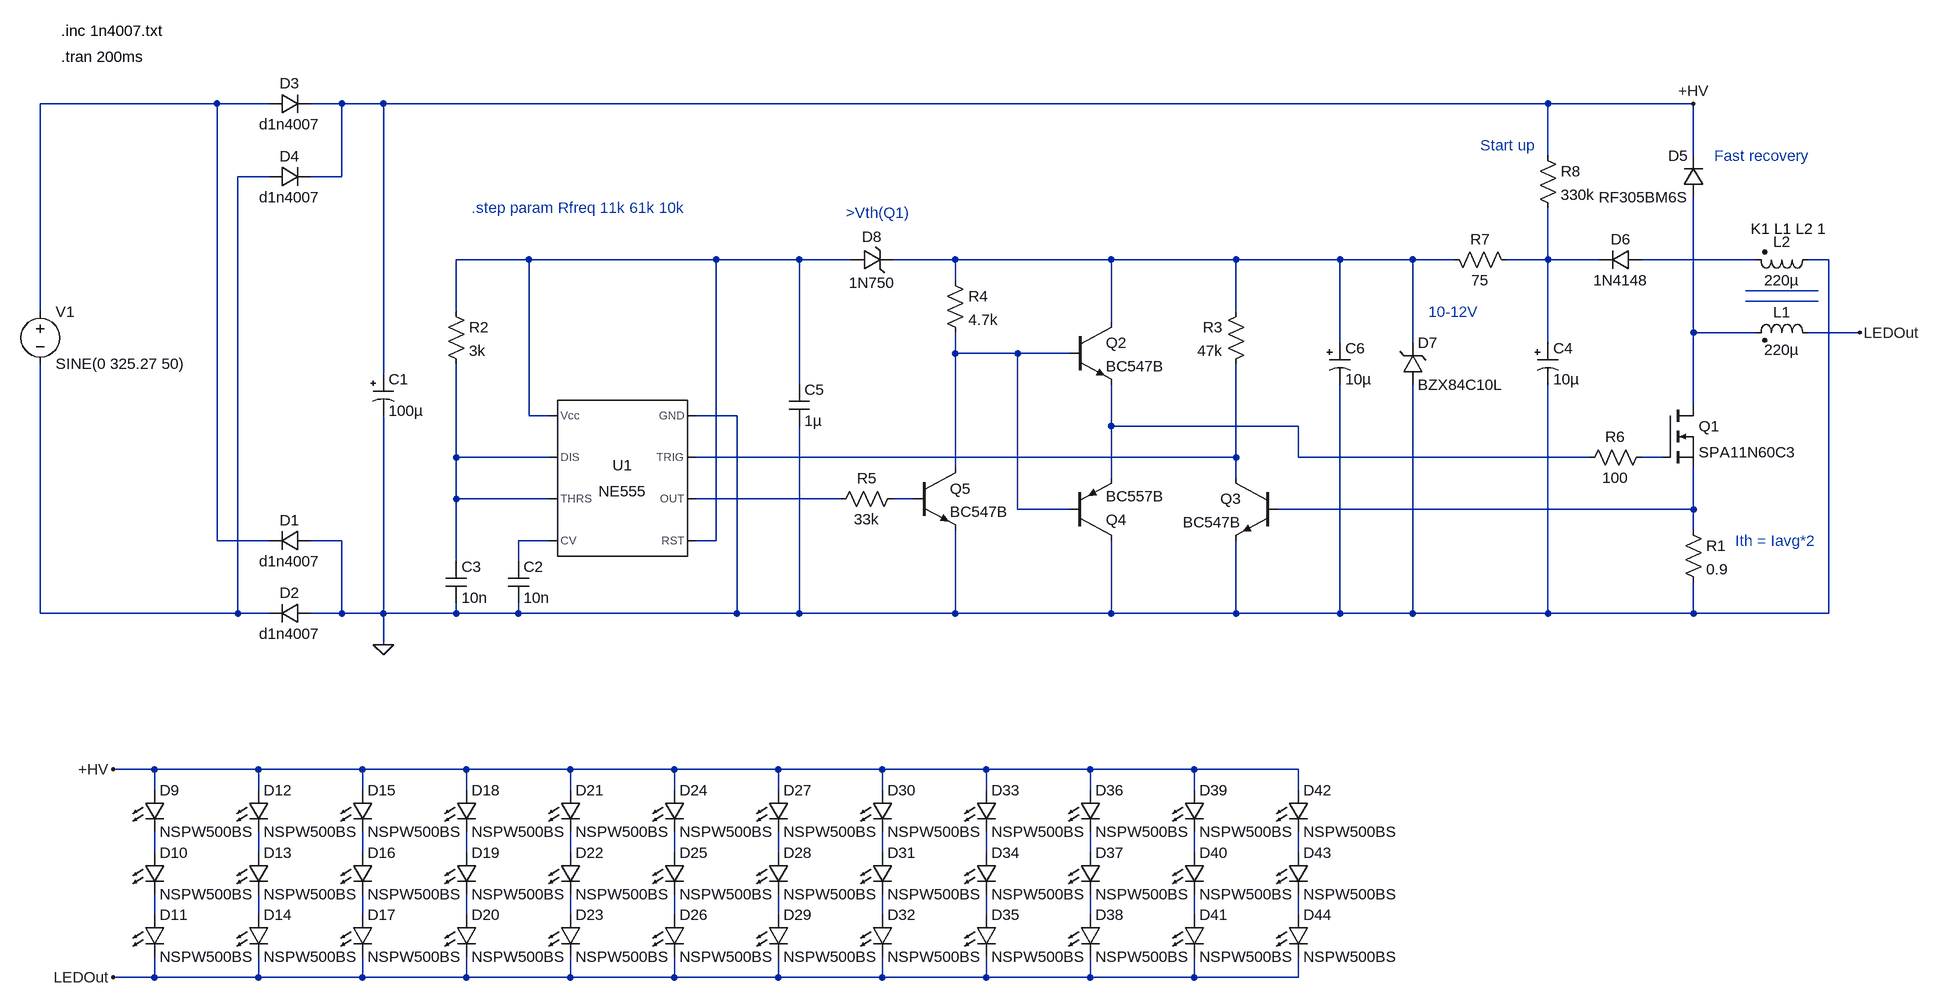
[diagram p0: schematic AC LED Driver LoV PP.asc]
AC LED Driver LoV PP.asc, the LTspice schematic file:
Version 4
SHEET 1 4020 1492
WIRE 416 -560 144 -560
WIRE 496 -560 416 -560
WIRE 608 -560 560 -560
WIRE 672 -560 608 -560
WIRE 2464 -560 672 -560
WIRE 2688 -560 2464 -560
WIRE 2464 -480 2464 -560
WIRE 2688 -480 2688 -560
WIRE 496 -448 448 -448
WIRE 608 -448 608 -560
WIRE 608 -448 560 -448
WIRE 896 -320 784 -320
WIRE 1184 -320 896 -320
WIRE 1312 -320 1184 -320
WIRE 1392 -320 1312 -320
WIRE 1552 -320 1456 -320
WIRE 1792 -320 1552 -320
WIRE 1984 -320 1792 -320
WIRE 2144 -320 1984 -320
WIRE 2256 -320 2144 -320
WIRE 2320 -320 2256 -320
WIRE 2464 -320 2464 -400
WIRE 2464 -320 2400 -320
WIRE 2544 -320 2464 -320
WIRE 2784 -320 2608 -320
WIRE 2896 -320 2864 -320
WIRE 1552 -288 1552 -320
WIRE 144 -240 144 -560
WIRE 784 -240 784 -320
WIRE 1984 -240 1984 -320
WIRE 1792 -224 1792 -320
WIRE 2688 -208 2688 -416
WIRE 2784 -208 2688 -208
WIRE 2944 -208 2864 -208
WIRE 2144 -192 2144 -320
WIRE 2256 -192 2256 -320
WIRE 2464 -192 2464 -320
WIRE 1552 -176 1552 -208
WIRE 1648 -176 1552 -176
WIRE 1728 -176 1648 -176
WIRE 672 -144 672 -560
WIRE 1312 -128 1312 -320
WIRE 2688 -96 2688 -208
WIRE 896 -80 896 -320
WIRE 928 -80 896 -80
WIRE 1216 -80 1152 -80
WIRE 1792 -64 1792 -128
WIRE 2080 -64 1792 -64
WIRE 784 -16 784 -160
WIRE 928 -16 784 -16
WIRE 1984 -16 1984 -160
WIRE 1984 -16 1152 -16
WIRE 2080 -16 2080 -64
WIRE 2528 -16 2080 -16
WIRE 2640 -16 2608 -16
WIRE 1552 0 1552 -176
WIRE 1792 16 1792 -64
WIRE 1984 16 1984 -16
WIRE 784 48 784 -16
WIRE 928 48 784 48
WIRE 1376 48 1152 48
WIRE 1488 48 1456 48
WIRE 1648 64 1648 -176
WIRE 1728 64 1648 64
WIRE 2688 64 2688 0
WIRE 2688 64 2048 64
WIRE 2688 96 2688 64
WIRE 416 112 416 -560
WIRE 496 112 416 112
WIRE 608 112 560 112
WIRE 928 112 880 112
WIRE 1184 112 1184 -320
WIRE 1184 112 1152 112
WIRE 784 144 784 48
WIRE 880 144 880 112
WIRE 144 224 144 -160
WIRE 448 224 448 -448
WIRE 448 224 144 224
WIRE 496 224 448 224
WIRE 608 224 608 112
WIRE 608 224 560 224
WIRE 672 224 672 -80
WIRE 672 224 608 224
WIRE 784 224 784 208
WIRE 784 224 672 224
WIRE 880 224 880 208
WIRE 880 224 784 224
WIRE 1216 224 1216 -80
WIRE 1216 224 880 224
WIRE 1312 224 1312 -64
WIRE 1312 224 1216 224
WIRE 1552 224 1552 96
WIRE 1552 224 1312 224
WIRE 1792 224 1792 112
WIRE 1792 224 1552 224
WIRE 1984 224 1984 112
WIRE 1984 224 1792 224
WIRE 2144 224 2144 -128
WIRE 2144 224 1984 224
WIRE 2256 224 2256 -128
WIRE 2256 224 2144 224
WIRE 2464 224 2464 -128
WIRE 2464 224 2256 224
WIRE 2688 224 2688 176
WIRE 2688 224 2464 224
WIRE 2896 224 2896 -320
WIRE 2896 224 2688 224
WIRE 672 272 672 224
WIRE 320 464 256 464
WIRE 480 464 320 464
WIRE 640 464 480 464
WIRE 800 464 640 464
WIRE 960 464 800 464
WIRE 1120 464 960 464
WIRE 1280 464 1120 464
WIRE 1440 464 1280 464
WIRE 1600 464 1440 464
WIRE 1760 464 1600 464
WIRE 1920 464 1760 464
WIRE 2080 464 1920 464
WIRE 320 496 320 464
WIRE 480 496 480 464
WIRE 640 496 640 464
WIRE 800 496 800 464
WIRE 960 496 960 464
WIRE 1120 496 1120 464
WIRE 1280 496 1280 464
WIRE 1440 496 1440 464
WIRE 1600 496 1600 464
WIRE 1760 496 1760 464
WIRE 1920 496 1920 464
WIRE 2080 496 2080 464
WIRE 320 592 320 560
WIRE 480 592 480 560
WIRE 640 592 640 560
WIRE 800 592 800 560
WIRE 960 592 960 560
WIRE 1120 592 1120 560
WIRE 1280 592 1280 560
WIRE 1440 592 1440 560
WIRE 1600 592 1600 560
WIRE 1760 592 1760 560
WIRE 1920 592 1920 560
WIRE 2080 592 2080 560
WIRE 320 688 320 656
WIRE 480 688 480 656
WIRE 640 688 640 656
WIRE 800 688 800 656
WIRE 960 688 960 656
WIRE 1120 688 1120 656
WIRE 1280 688 1280 656
WIRE 1440 688 1440 656
WIRE 1600 688 1600 656
WIRE 1760 688 1760 656
WIRE 1920 688 1920 656
WIRE 2080 688 2080 656
WIRE 320 784 320 752
WIRE 320 784 256 784
WIRE 480 784 480 752
WIRE 480 784 320 784
WIRE 640 784 640 752
WIRE 640 784 480 784
WIRE 800 784 800 752
WIRE 800 784 640 784
WIRE 960 784 960 752
WIRE 960 784 800 784
WIRE 1120 784 1120 752
WIRE 1120 784 960 784
WIRE 1280 784 1280 752
WIRE 1280 784 1120 784
WIRE 1440 784 1440 752
WIRE 1440 784 1280 784
WIRE 1600 784 1600 752
WIRE 1600 784 1440 784
WIRE 1760 784 1760 752
WIRE 1760 784 1600 784
WIRE 1920 784 1920 752
WIRE 1920 784 1760 784
WIRE 2080 784 2080 752
WIRE 2080 784 1920 784
FLAG 672 272 0
FLAG 256 464 +HV
FLAG 256 784 LEDOut
FLAG 2688 -560 +HV
FLAG 2944 -208 LEDOut
SYMBOL voltage 144 -256 R0
WINDOW 123 0 0 Left 2
WINDOW 39 0 0 Left 2
SYMATTR InstName V1
SYMATTR Value SINE(0 325.27 50)
SYMBOL diode 560 96 R90
WINDOW 0 0 32 VBottom 2
WINDOW 3 32 32 VTop 2
SYMATTR InstName D1
SYMATTR Value d1n4007
SYMBOL diode 560 208 R90
WINDOW 0 0 32 VBottom 2
WINDOW 3 32 32 VTop 2
SYMATTR InstName D2
SYMATTR Value d1n4007
SYMBOL diode 496 -544 R270
WINDOW 0 32 32 VTop 2
WINDOW 3 0 32 VBottom 2
SYMATTR InstName D3
SYMATTR Value d1n4007
SYMBOL diode 496 -432 R270
WINDOW 0 32 32 VTop 2
WINDOW 3 0 32 VBottom 2
SYMATTR InstName D4
SYMATTR Value d1n4007
SYMBOL polcap 656 -144 R0
SYMATTR InstName C1
SYMATTR Value 100µ
SYMBOL nmos 2640 -96 R0
SYMATTR InstName Q1
SYMATTR Value SPA11N60C3
SYMBOL ind2 2880 -192 M270
WINDOW 0 32 56 VTop 2
WINDOW 3 5 56 VBottom 2
SYMATTR InstName L1
SYMATTR Value 220µ
SYMATTR Type ind
SYMBOL diode 2704 -416 R180
WINDOW 0 24 64 Left 2
WINDOW 3 24 0 Left 2
SYMATTR InstName D5
SYMATTR Value RF305BM6S
SYMBOL res 2672 80 R0
SYMATTR InstName R1
SYMATTR Value 0.9
SYMBOL npn 1728 -224 R0
SYMATTR InstName Q2
SYMATTR Value BC547B
SYMBOL cap 864 144 R0
SYMATTR InstName C2
SYMATTR Value 10n
SYMBOL cap 768 144 R0
SYMATTR InstName C3
SYMATTR Value 10n
SYMBOL res 768 -256 R0
SYMATTR InstName R2
SYMATTR Value 3k
SYMBOL npn 2048 16 M0
SYMATTR InstName Q3
SYMATTR Value BC547B
SYMBOL res 2000 -256 M0
SYMATTR InstName R3
SYMATTR Value 47k
SYMBOL res 2512 0 R270
WINDOW 0 32 56 VTop 2
WINDOW 3 0 56 VBottom 2
SYMATTR InstName R6
SYMATTR Value 100
SYMBOL Misc\\NE555 1040 16 M0
SYMATTR InstName U1
SYMBOL ind2 2880 -336 R90
WINDOW 0 4 56 VBottom 2
WINDOW 3 32 56 VTop 2
SYMATTR InstName L2
SYMATTR Value 220µ
SYMATTR Type ind
SYMBOL diode 2608 -336 R90
WINDOW 0 0 32 VBottom 2
WINDOW 3 32 32 VTop 2
SYMATTR InstName D6
SYMATTR Value 1N4148
SYMBOL polcap 2448 -192 R0
SYMATTR InstName C4
SYMATTR Value 10µ
SYMBOL res 2416 -304 M270
WINDOW 0 32 56 VTop 2
WINDOW 3 0 56 VBottom 2
SYMATTR InstName R7
SYMATTR Value 75
SYMBOL zener 2240 -128 M180
WINDOW 0 24 64 Left 2
WINDOW 3 24 0 Left 2
SYMATTR InstName D7
SYMATTR Value BZX84C10L
SYMBOL res 2448 -496 R0
SYMATTR InstName R8
SYMATTR Value 330k
SYMBOL cap 1296 -128 R0
SYMATTR InstName C5
SYMATTR Value 1µ
SYMBOL LED 304 496 R0
SYMATTR InstName D9
SYMATTR Value NSPW500BS
SYMBOL LED 304 592 R0
SYMATTR InstName D10
SYMATTR Value NSPW500BS
SYMBOL LED 304 688 R0
SYMATTR InstName D11
SYMATTR Value NSPW500BS
SYMBOL LED 464 496 R0
SYMATTR InstName D12
SYMATTR Value NSPW500BS
SYMBOL LED 464 592 R0
SYMATTR InstName D13
SYMATTR Value NSPW500BS
SYMBOL LED 464 688 R0
SYMATTR InstName D14
SYMATTR Value NSPW500BS
SYMBOL LED 624 496 R0
SYMATTR InstName D15
SYMATTR Value NSPW500BS
SYMBOL LED 624 592 R0
SYMATTR InstName D16
SYMATTR Value NSPW500BS
SYMBOL LED 624 688 R0
SYMATTR InstName D17
SYMATTR Value NSPW500BS
SYMBOL LED 784 496 R0
SYMATTR InstName D18
SYMATTR Value NSPW500BS
SYMBOL LED 784 592 R0
SYMATTR InstName D19
SYMATTR Value NSPW500BS
SYMBOL LED 784 688 R0
SYMATTR InstName D20
SYMATTR Value NSPW500BS
SYMBOL LED 944 496 R0
SYMATTR InstName D21
SYMATTR Value NSPW500BS
SYMBOL LED 944 592 R0
SYMATTR InstName D22
SYMATTR Value NSPW500BS
SYMBOL LED 944 688 R0
SYMATTR InstName D23
SYMATTR Value NSPW500BS
SYMBOL LED 1104 496 R0
SYMATTR InstName D24
SYMATTR Value NSPW500BS
SYMBOL LED 1104 592 R0
SYMATTR InstName D25
SYMATTR Value NSPW500BS
SYMBOL LED 1104 688 R0
SYMATTR InstName D26
SYMATTR Value NSPW500BS
SYMBOL LED 1264 496 R0
SYMATTR InstName D27
SYMATTR Value NSPW500BS
SYMBOL LED 1264 592 R0
SYMATTR InstName D28
SYMATTR Value NSPW500BS
SYMBOL LED 1264 688 R0
SYMATTR InstName D29
SYMATTR Value NSPW500BS
SYMBOL LED 1424 496 R0
SYMATTR InstName D30
SYMATTR Value NSPW500BS
SYMBOL LED 1424 592 R0
SYMATTR InstName D31
SYMATTR Value NSPW500BS
SYMBOL LED 1424 688 R0
SYMATTR InstName D32
SYMATTR Value NSPW500BS
SYMBOL LED 1584 496 R0
SYMATTR InstName D33
SYMATTR Value NSPW500BS
SYMBOL LED 1584 592 R0
SYMATTR InstName D34
SYMATTR Value NSPW500BS
SYMBOL LED 1584 688 R0
SYMATTR InstName D35
SYMATTR Value NSPW500BS
SYMBOL LED 1744 496 R0
SYMATTR InstName D36
SYMATTR Value NSPW500BS
SYMBOL LED 1744 592 R0
SYMATTR InstName D37
SYMATTR Value NSPW500BS
SYMBOL LED 1744 688 R0
SYMATTR InstName D38
SYMATTR Value NSPW500BS
SYMBOL LED 1904 496 R0
SYMATTR InstName D39
SYMATTR Value NSPW500BS
SYMBOL LED 1904 592 R0
SYMATTR InstName D40
SYMATTR Value NSPW500BS
SYMBOL LED 1904 688 R0
SYMATTR InstName D41
SYMATTR Value NSPW500BS
SYMBOL LED 2064 496 R0
SYMATTR InstName D42
SYMATTR Value NSPW500BS
SYMBOL LED 2064 592 R0
SYMATTR InstName D43
SYMATTR Value NSPW500BS
SYMBOL LED 2064 688 R0
SYMATTR InstName D44
SYMATTR Value NSPW500BS
SYMBOL pnp 1728 112 M180
SYMATTR InstName Q4
SYMATTR Value BC557B
SYMBOL npn 1488 0 R0
SYMATTR InstName Q5
SYMATTR Value BC547B
SYMBOL res 1536 -304 R0
SYMATTR InstName R4
SYMATTR Value 4.7k
SYMBOL res 1360 64 R270
WINDOW 0 32 56 VTop 2
WINDOW 3 0 56 VBottom 2
SYMATTR InstName R5
SYMATTR Value 33k
SYMBOL zener 1392 -304 R270
WINDOW 0 36 32 VTop 2
WINDOW 3 -4 32 VBottom 2
SYMATTR InstName D8
SYMATTR Value 1N750
SYMBOL polcap 2128 -192 R0
SYMATTR InstName C6
SYMATTR Value 10µ
TEXT 176 -632 Left 2 !.tran 200ms
TEXT 176 -672 Left 2 !.inc 1n4007.txt
TEXT 2776 -368 Left 2 !K1 L1 L2 1
TEXT 808 -400 Left 2 ;.step param Rfreq 11k 61k 10k
TEXT 1384 -392 Left 2 ;>Vth(Q1)
TEXT 2360 -496 Left 2 ;Start up
TEXT 2752 112 Left 2 ;Ith = Iavg*2
TEXT 2720 -480 Left 2 ;Fast recovery
TEXT 2280 -240 Left 2 ;10-12V
LINE Normal 2880 -272 2768 -272
LINE Normal 2880 -256 2768 -256

The netlist it stands for:
* AC LED Driver LoV PP.asc
V1 N001 N002 SINE(0 325.27 50)
D1 0 N001 d1n4007
D2 0 N002 d1n4007
D3 N001 +HV d1n4007
D4 N002 +HV d1n4007
C1 +HV 0 100µ
M§Q1 N007 N012 N015 N015 SPA11N60C3
L1 LEDOut N007 220µ
D5 N007 +HV RF305BM6S
R1 N015 0 0.9
Q2 N004 N008 N009 0 BC547B
C2 N016 0 10n
C3 N010 0 10n
R2 N003 N010 3k
Q3 N011 N015 0 0 BC547B
R3 N004 N011 47k
R6 N009 N012 100
XU1 0 N011 N013 N003 N016 N010 N010 N003 NE555  ; pins GND TRIG OUT RST CV THRS DIS Vcc
L2 0 N006 220µ
D6 N006 N005 1N4148
C4 N005 0 10µ
R7 N005 N004 75
D7 0 N004 BZX84C10L
R8 +HV N005 330k
C5 N003 0 1µ
D9 +HV N017 NSPW500BS
D10 N017 N029 NSPW500BS
D11 N029 LEDOut NSPW500BS
D12 +HV N018 NSPW500BS
D13 N018 N030 NSPW500BS
D14 N030 LEDOut NSPW500BS
D15 +HV N019 NSPW500BS
D16 N019 N031 NSPW500BS
D17 N031 LEDOut NSPW500BS
D18 +HV N020 NSPW500BS
D19 N020 N032 NSPW500BS
D20 N032 LEDOut NSPW500BS
D21 +HV N021 NSPW500BS
D22 N021 N033 NSPW500BS
D23 N033 LEDOut NSPW500BS
D24 +HV N022 NSPW500BS
D25 N022 N034 NSPW500BS
D26 N034 LEDOut NSPW500BS
D27 +HV N023 NSPW500BS
D28 N023 N035 NSPW500BS
D29 N035 LEDOut NSPW500BS
D30 +HV N024 NSPW500BS
D31 N024 N036 NSPW500BS
D32 N036 LEDOut NSPW500BS
D33 +HV N025 NSPW500BS
D34 N025 N037 NSPW500BS
D35 N037 LEDOut NSPW500BS
D36 +HV N026 NSPW500BS
D37 N026 N038 NSPW500BS
D38 N038 LEDOut NSPW500BS
D39 +HV N027 NSPW500BS
D40 N027 N039 NSPW500BS
D41 N039 LEDOut NSPW500BS
D42 +HV N028 NSPW500BS
D43 N028 N040 NSPW500BS
D44 N040 LEDOut NSPW500BS
Q4 0 N008 N009 0 BC557B
Q5 N008 N014 0 0 BC547B
R4 N004 N008 4.7k
R5 N013 N014 33k
D8 N003 N004 1N750
C6 N004 0 10µ
.model D D
.lib standard.dio
.model NPN NPN
.model PNP PNP
.lib standard.bjt
.model NMOS NMOS
.model PMOS PMOS
.lib standard.mos
.tran 200ms
.inc 1n4007.txt
K1 L1 L2 1
* .step param Rfreq 11k 61k 10k
* >Vth(Q1)
* Start up
* Ith = Iavg*2
* Fast recovery
* 10-12V
.lib NE555.sub
.backanno
.end